# EAGLE design ADAC-Shield (EAGLE 6.5.0)
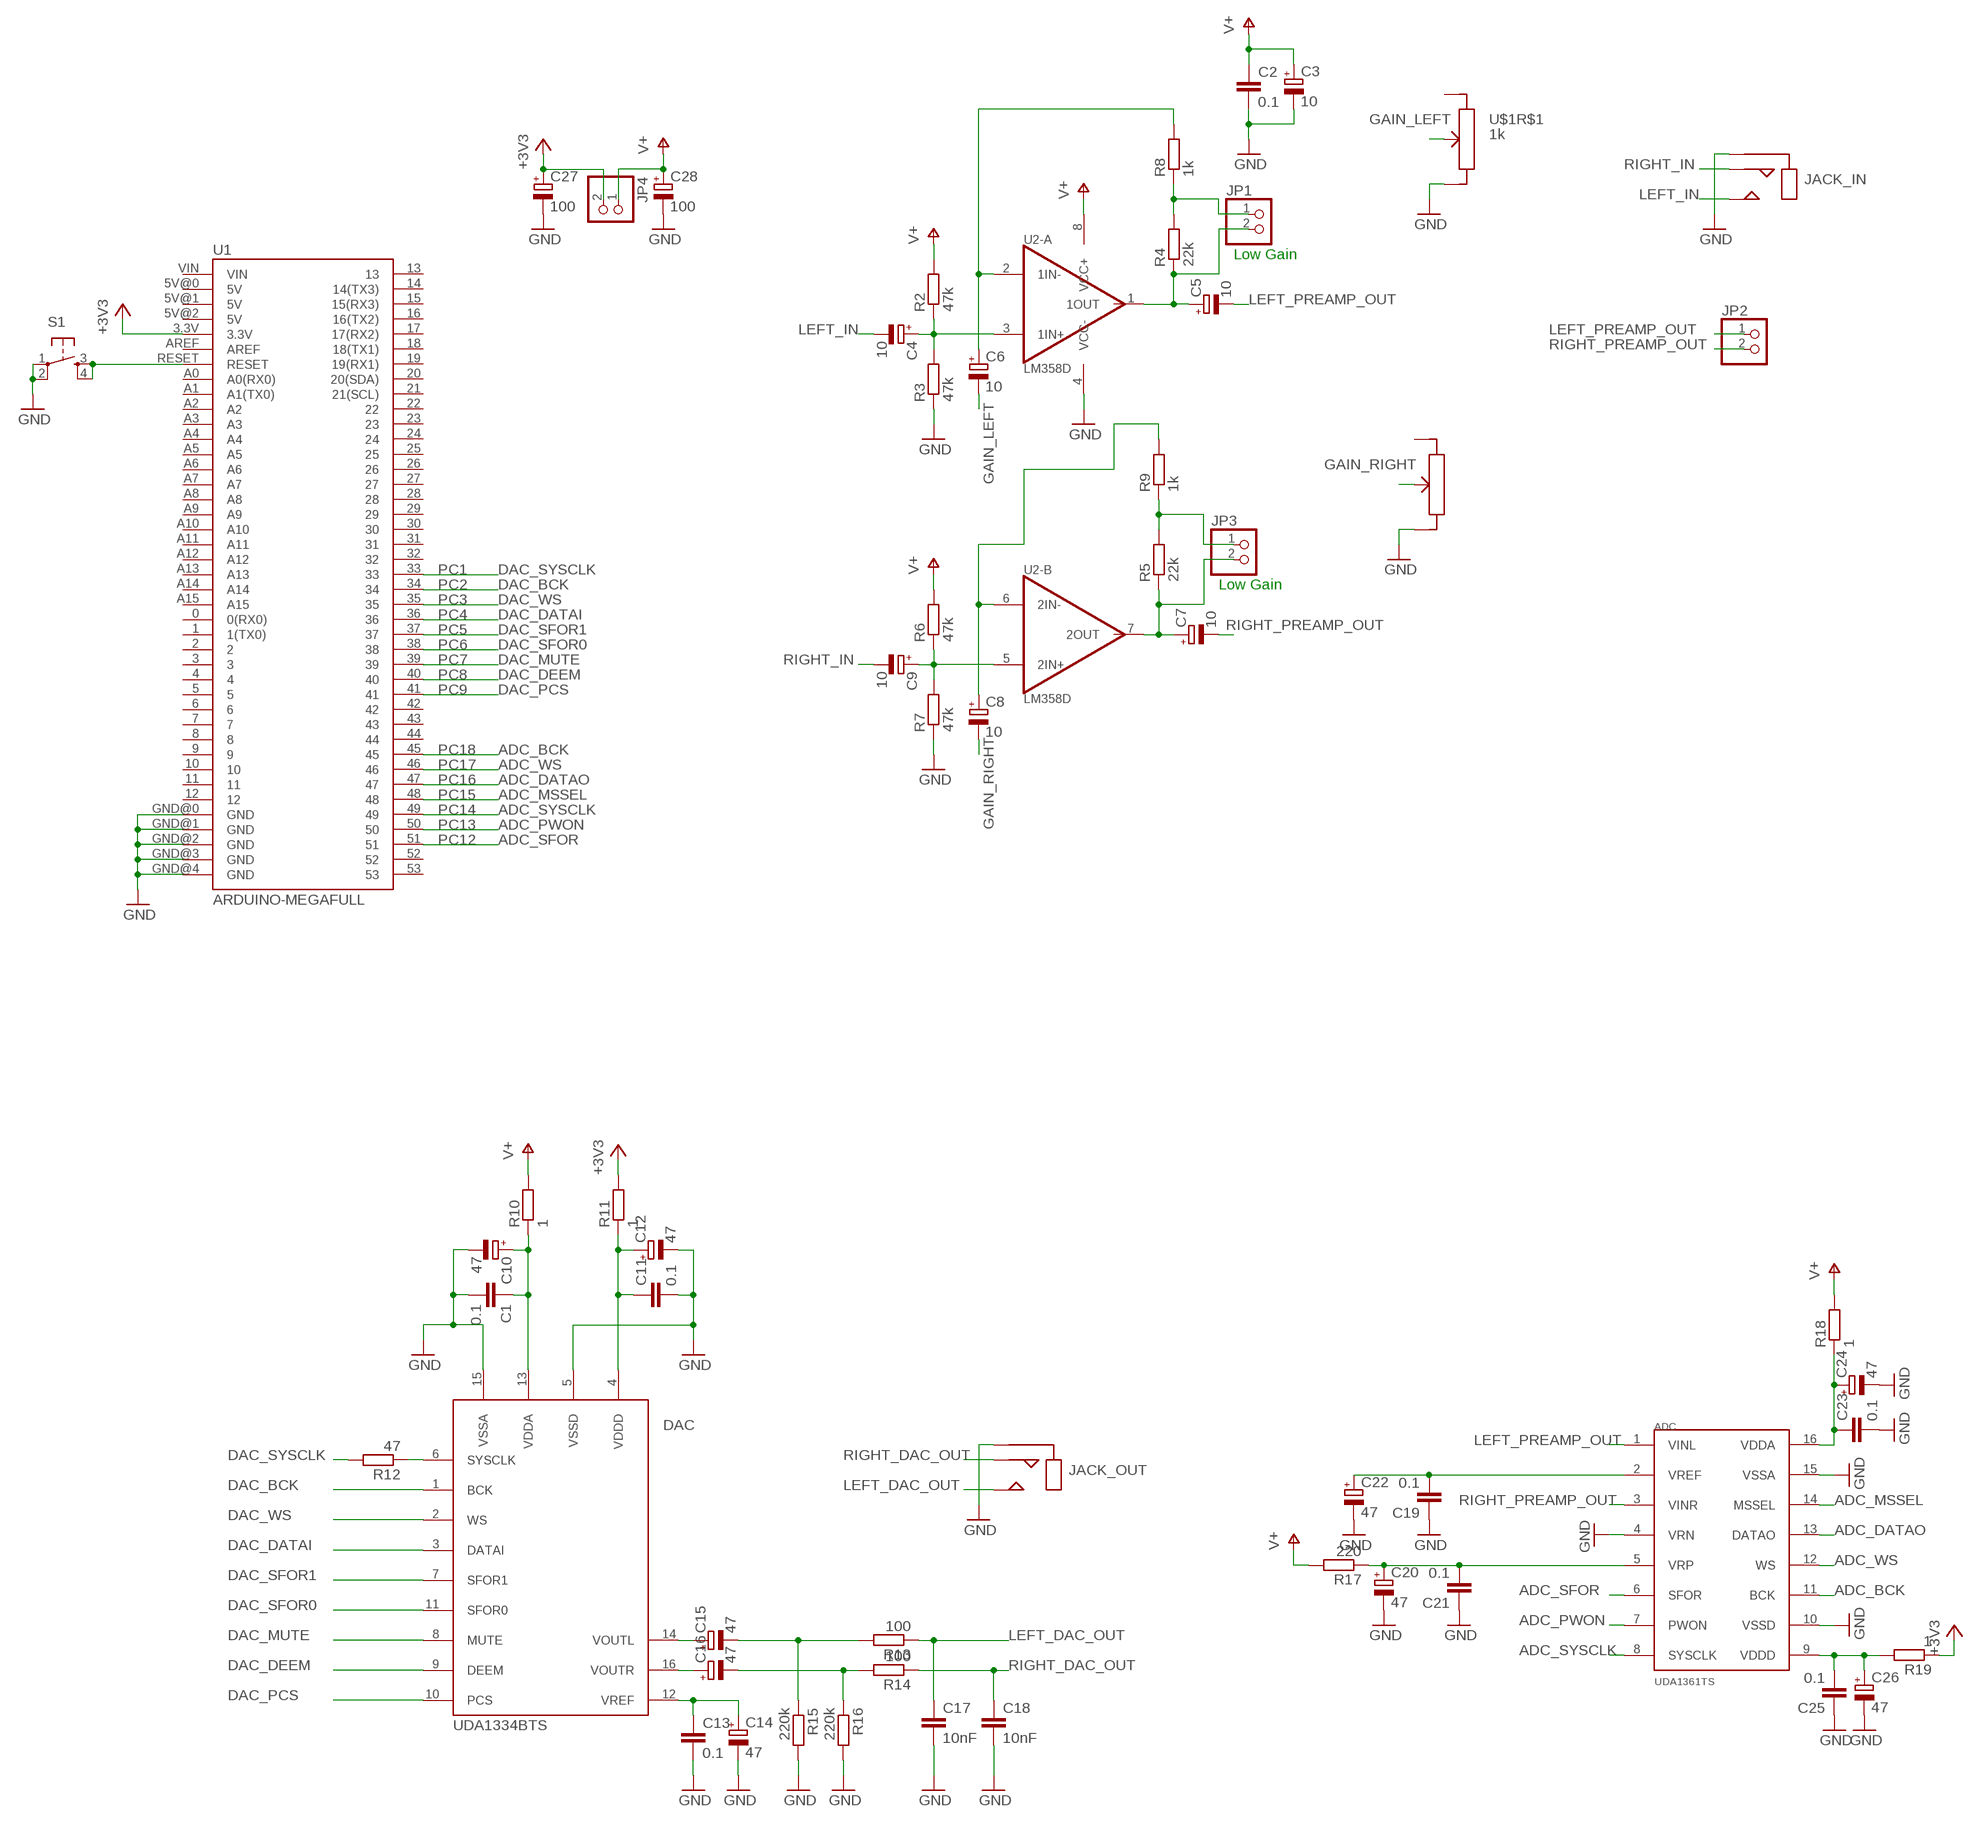
[diagram p0: schematic, sheet 1]

## Parts
ADC  UDA1361TS  [SSOP16]
C1  0.1  C-EUC0805  [C0805]
C2  0.1  C-EUC0805  [C0805]
C3  10  CPOL-EUA  [PANASONIC_A]
C4  10  CPOL-EUA  [PANASONIC_A]
C5  10  CPOL-EUA  [PANASONIC_A]
C6  10  CPOL-EUA  [PANASONIC_A]
C7  10  CPOL-EUA  [PANASONIC_A]
C8  10  CPOL-EUA  [PANASONIC_A]
C9  10  CPOL-EUA  [PANASONIC_A]
C10  47  CPOL-EUA  [PANASONIC_A]
C11  0.1  C-EUC0805  [C0805]
C12  47  CPOL-EUA  [PANASONIC_A]
C13  0.1  C-EUC0805  [C0805]
C14  47  CPOL-EUA  [PANASONIC_A]
C15  47  CPOL-EUA  [PANASONIC_A]
C16  47  CPOL-EUA  [PANASONIC_A]
C17  10nF  C-EUC0805  [C0805]
C18  10nF  C-EUC0805  [C0805]
C19  0.1  C-EUC0805  [C0805]
C20  47  CPOL-EUA  [PANASONIC_A]
C21  0.1  C-EUC0805  [C0805]
C22  47  CPOL-EUA  [PANASONIC_A]
C23  0.1  C-EUC0805  [C0805]
C24  47  CPOL-EUA  [PANASONIC_A]
C25  0.1  C-EUC0805  [C0805]
C26  47  CPOL-EUA  [PANASONIC_A]
C27  100  CPOL-EUB  [PANASONIC_B]
C28  100  CPOL-EUB  [PANASONIC_B]
DAC  UDA1334BTS  [SSOP16]
JACK_IN  ST-11M-0  [ST-11M-0]
JACK_OUT  ST-11M-0  [ST-11M-0]
JP1  PINHD-1X2  [1X02]
JP2  PINHD-1X2  [1X02]
JP3  PINHD-1X2  [1X02]
JP4  PINHD-1X2  [1X02]
R2  47k  R-EU_R0805  [R0805]
R3  47k  R-EU_R0805  [R0805]
R4  22k  R-EU_R0805  [R0805]
R5  22k  R-EU_R0805  [R0805]
R6  47k  R-EU_R0805  [R0805]
R7  47k  R-EU_R0805  [R0805]
R8  1k  R-EU_R0805  [R0805]
R9  1k  R-EU_R0805  [R0805]
R10  1  R-EU_R0805  [R0805]
R11  1  R-EU_R0805  [R0805]
R12  47  R-EU_R0805  [R0805]
R13  100  R-EU_R0805  [R0805]
R14  100  R-EU_R0805  [R0805]
R15  220k  R-EU_R0805  [R0805]
R16  220k  R-EU_R0805  [R0805]
R17  220  R-EU_R0805  [R0805]
R18  1  R-EU_R0805  [R0805]
R19  1  R-EU_R0805  [R0805]
S1  TAC_SWITCHSMD  [TACTILE_SWITCH_SMD]
U1  ARDUINO-MEGAFULL  [ARDUINO_MEGA]
U2  LM358D  1680-LM358DT  [ANDREW/B37Z6]
U$1  1k  POT_DUAL_R16  [POT_DUAL_R16]

## Nets
+3V3: C27.+ JP4.2 R11.2 R19.1 U1.3.3V
ADC_BCK: ADC.11(BCK) U1.45
ADC_DATAO: ADC.13(DATAO) U1.47
ADC_MSSEL: ADC.14(MSSEL) U1.48
ADC_PWON: ADC.7(PWON) U1.50
ADC_SFOR: ADC.6(SFOR) U1.51
ADC_SYSCLK: ADC.8(SYSCLK) U1.49
ADC_WS: ADC.12(WS) U1.46
DAC_BCK: DAC.1(BCK) U1.34
DAC_DATAI: DAC.3(DATAI) U1.36
DAC_DEEM: DAC.9(DEEM) U1.40
DAC_MUTE: DAC.8(MUTE) U1.39
DAC_PCS: DAC.10(PCS) U1.41
DAC_SFOR0: DAC.11(SFOR0) U1.38
DAC_SFOR1: DAC.7(SFOR1) U1.37
DAC_SYSCLK: R12.2 U1.33
DAC_WS: DAC.2(WS) U1.35
GAIN_LEFT: C6.- U$1.TRIMMER(R$1:TRIMMER)
GAIN_RIGHT: C8.- U$1.TRIMMER2
GND: ADC.4(VRN) ADC.10(VSSD) ADC.15(VSSA) C1.2 C2.2 C3.- C10.- C11.2 C12.- C13.2 C14.- C17.2 C18.2 C19.1 C20.- C21.1 C22.- C23.2 C24.- C25.1 C26.- C27.- C28.- DAC.5(VSSD) DAC.15(VSSA) JACK_IN.SLEEVE JACK_OUT.SLEEVE R3.1 R7.1 R15.2 R16.2 S1.1 S1.2 U1.GND@0(GND) U1.GND@1(GND) U1.GND@2(GND) U1.GND@3(GND) U1.GND@4(GND) U2.4(-A:VCC-) U$1.BOTTOM2 U$1.BOTTOM(R$1:BOTTOM)
LEFT_DAC_OUT: C17.1 JACK_OUT.TIP R13.1
LEFT_IN: C4.- JACK_IN.TIP
LEFT_PREAMP_OUT: ADC.1(VINL) C5.- JP2.1
N$1: C4.+ R2.1 R3.2 U2.3(-A:1IN+)
N$2: C5.+ JP1.2 R4.1 U2.1(-A:1OUT)
N$3: S1.3 S1.4 U1.RESET
N$4: C6.+ R8.2 U2.2(-A:1IN-)
N$5: C7.+ JP3.2 R5.1 U2.7(-B:2OUT)
N$6: C11.1 C12.+ DAC.4(VDDD) R11.1
N$7: C8.+ R9.2 U2.6(-B:2IN-)
N$8: C9.+ R6.1 R7.2 U2.5(-B:2IN+)
N$9: JP1.1 R4.2 R8.1
N$10: C1.1 C10.+ DAC.13(VDDA) R10.1
N$11: JP3.1 R5.2 R9.1
N$12: DAC.6(SYSCLK) R12.1
N$13: C13.1 C14.+ DAC.12(VREF)
N$14: C15.+ DAC.14(VOUTL)
N$15: C16.+ DAC.16(VOUTR)
N$16: C15.- R13.2 R15.1
N$17: C16.- R14.2 R16.1
N$18: ADC.2(VREF) C19.2 C22.+
N$19: ADC.5(VRP) C20.+ C21.2 R17.1
N$20: ADC.16(VDDA) C23.1 C24.+ R18.1
N$25: ADC.9(VDDD) C25.2 C26.+ R19.2
RIGHT_DAC_OUT: C18.1 JACK_OUT.RING R14.1
RIGHT_IN: C9.- JACK_IN.RING
RIGHT_PREAMP_OUT: ADC.3(VINR) C7.- JP2.2
V+: C2.1 C3.+ C28.+ JP4.1 R2.2 R6.2 R10.2 R17.2 R18.2 U2.8(-A:VCC+)
Unconnected: U1.0(0(RX0)) U1.1(1(TX0)) U1.2 U1.3 U1.4 U1.5 U1.5V@0(5V) U1.5V@1(5V) U1.5V@2(5V) U1.6 U1.7 U1.8 U1.9 U1.10 U1.11 U1.12 U1.13 U1.14(14(TX3)) U1.15(15(RX3)) U1.16(16(TX2)) U1.17(17(RX2)) U1.18(18(TX1)) U1.19(19(RX1)) U1.20(20(SDA)) U1.21(21(SCL)) U1.22 U1.23 U1.24 U1.25 U1.26 U1.27 U1.28 U1.29 U1.30 U1.31 U1.32 U1.42 U1.43 U1.44 U1.52 U1.53 U1.A0(A0(RX0)) U1.A1(A1(TX0)) U1.A2 U1.A3 U1.A4 U1.A5 U1.A6 U1.A7 U1.A8 U1.A9 U1.A10 U1.A11 U1.A12 U1.A13 U1.A14 U1.A15 U1.AREF U1.VIN U$1.UPPER2 U$1.UPPER(R$1:UPPER)

## Notes on the sheet
- Low Gain
- PC1
- PC2 | Low Gain
- PC3
- PC4
- PC5
- PC6
- PC7
- PC8
- PC9
- PC18
- PC17
- PC16
- PC15
- PC14
- PC13
- PC12

## Library data of the parts
ADC = smok:UDA1361TS: 96 kHz sampling 24-bit stereo audio ADC by Philips, http://www.rcscomponents.kiev.ua/modules/Asers_Shop/images/datasheets/UDA1361TS-N1%2C112.pdf
C1 C2 C11 C13 C17-C19 C21 C23 C25 = rcl:C-EU: CAPACITOR, European symbol
C3-C10 C12 C14-C16 C20 C22 C24 C26-C28 = rcl:CPOL-EU: POLARIZED CAPACITOR, European symbol
DAC = smok:UDA1334BTS: Low-power audio DAC by Philips, http://www.rcscomponents.kiev.ua/modules/Asers_Shop/images/datasheets/UDA1334BTS.pdf
JACK_IN JACK_OUT = smok:ST-11M-0: Audio jack narrow, http://www.rcscomponents.kiev.ua/modules/Asers_Shop/images/datasheets/ST-11M-0.pdf
JP1-JP4 = pinhead:PINHD-1X2: PIN HEADER
R2-R19 = rcl:R-EU_: RESISTOR, European symbol
S1 = SparkFun-Electromechanical:TAC_SWITCH: Momentary Switch Button commonly used for reset or general input. Spark Fun Electronics SKU : COM-00097 SMT- SWCH-08247; PROD_ID: SWCH-08247
U1 = SparkFun-Boards_modified:ARDUINO-MEGA: Arduino Mega board footprint
U2 = CircuitHub:1680-LM358DT; CIRCUITHUBID: 1680; FOOTPRINTREVISION: 2b0cb5c555c6535bfd0703ddb6519a7d2d03b0a4; FOOTPRINTURN: andrew/b37z6; SYMBOLREVISION: bf7dcb01558d8fc67fecfd6692ad2b1a99a1aebf; SYMBOLURN: wsender/dinu3; URL: https://circuithub.com/parts/STMICRO/LM358DT
U$1 = smok:POT_DUAL_R16: dual potentiometer, uknown brand, sold as R16. http://www.rcscomponents.kiev.ua/modules/Asers_Shop/images/datasheets/di2yt3i7tr8eggy82teufg562w3r.jpg

## Board
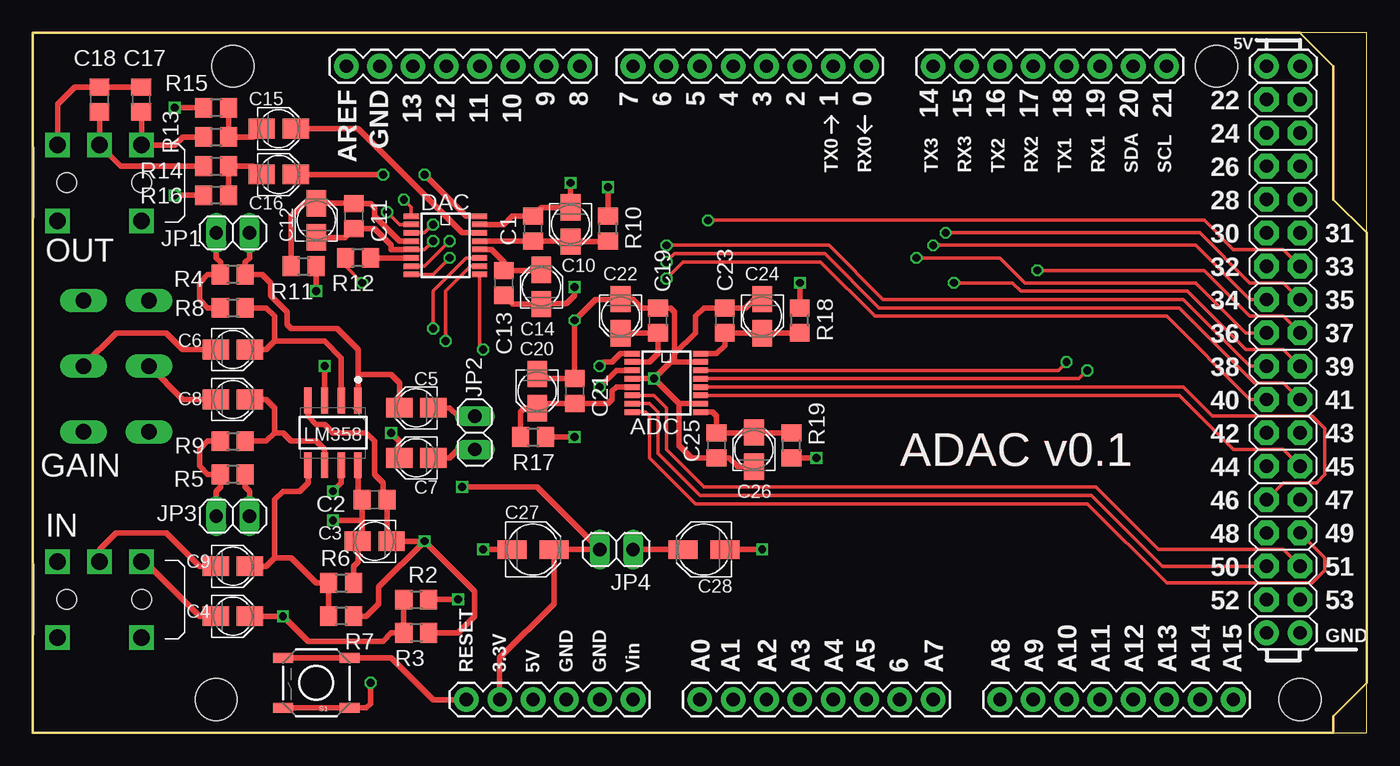
[diagram p1: board, top side]
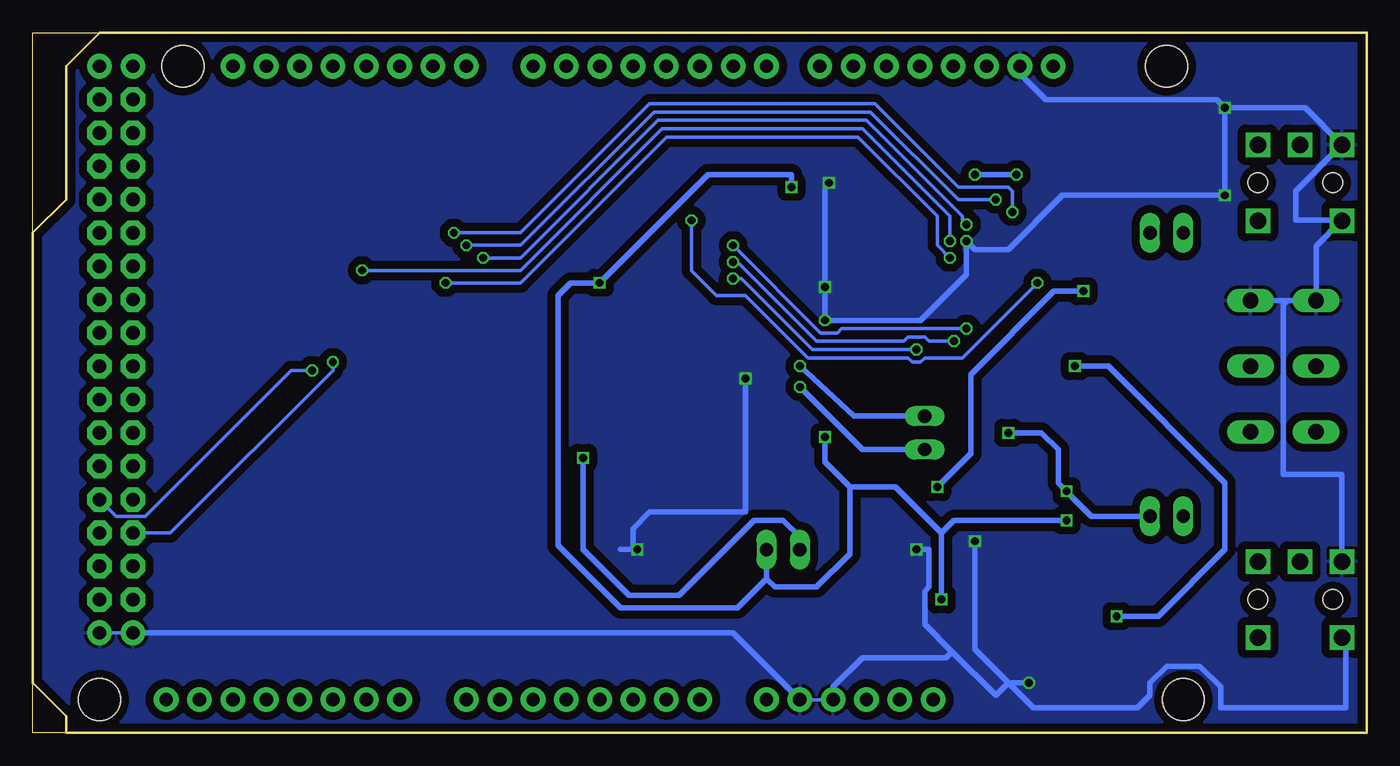
[diagram p2: board, bottom side, seen from below]

Size 101.6 x 53.34 mm. Coordinates in mm from the lower left corner, seen from the top.
Outline: 0,0 101.59,0 101.59,53.33 0,53.33 0,0
Copper layers (1*16): Top 0.035mm / dielectric 1.5mm / Bottom 0.035mm
Design rules "ITEADstudio_DRC": minimum track width 6mil, minimum drill 12mil, track to track 6mil, track to pad 6mil, pad to pad 6mil, via to via 6mil, smd to smd 0mil, copper to edge 10mil, drill to drill 10mil, minimum pad ring 10mil, minimum via ring 6mil, stop-mask expansion 2mil, vias tented up to drill 100mil, thermal gap 10mil

### Footprints (pad centres in the part's own frame; a part is rotated, then mirrored left to right if it is on the bottom)
SSOP16 = smd 0.419 x 1.143: 1 -2.223,-2.6; 2 -1.587,-2.6; 3 -0.953,-2.6; 4 -0.318,-2.6; 5 0.318,-2.6; 6 0.953,-2.6; 7 1.587,-2.6; 8 2.223,-2.6; 9 2.223,2.6; 10 1.587,2.6; 11 0.953,2.6; 12 0.318,2.6; 13 -0.318,2.6; 14 -0.953,2.6; 15 -1.587,2.6; 16 -2.223,2.6
C0805 = smd 1.3 x 1.5: 1 -0.95,0; 2 0.95,0
PANASONIC_A = smd 2 x 1.5: + 1.3,0; - -1.3,0
PANASONIC_B = smd 2.2 x 1.4: + 1.6,0; - -1.6,0
ST-11M-0 = drill 1.25 square: RING 0,2.9; SLEEVE -3.2,2.9; SLEEVE2 -3.2,-2.9; TIP 3.2,2.9; TIP2 3.2,-2.9 | hole 1.5: -2.5,0; 3.2,0
1X02 = drill 1.016 long: 1 -1.27,0; 2 1.27,0
R0805 = smd 1.3 x 1.5: 1 -0.95,0; 2 0.95,0
TACTILE_SWITCH_SMD = smd 1.524 x 0.762: 1 -2.54,1.905; 2 2.54,1.905; 3 -2.54,-1.905; 4 2.54,-1.905
ARDUINO_MEGA = drill 1.016 pad 1.88: 0 63.5,50.8; 1 60.96,50.8; 2 58.42,50.8; 3 55.88,50.8; 3.3V 35.56,2.54; 4 53.34,50.8; 5 50.8,50.8; 5V@0 38.1,2.54; 5V@1 93.98,50.8; 5V@2 96.52,50.8; 6 48.26,50.8; 7 45.72,50.8; 8 41.656,50.8; 9 39.116,50.8; 10 36.576,50.8; 11 34.036,50.8; 12 31.496,50.8; 13 28.956,50.8; 14 68.58,50.8; 15 71.12,50.8; 16 73.66,50.8; 17 76.2,50.8; 18 78.74,50.8; 19 81.28,50.8; 20 83.82,50.8; 21 86.36,50.8; A0 50.8,2.54; A1 53.34,2.54; A2 55.88,2.54; A3 58.42,2.54; A4 60.96,2.54; A5 63.5,2.54; A6 66.04,2.54; A7 68.58,2.54; A8 73.66,2.54; A9 76.2,2.54; A10 78.74,2.54; A11 81.28,2.54; A12 83.82,2.54; A13 86.36,2.54; A14 88.9,2.54; A15 91.44,2.54; AREF 23.876,50.8; GND@0 40.64,2.54; GND@1 43.18,2.54; GND@2 93.98,7.62; GND@3 96.52,7.62; GND@4 26.416,50.8; RESET 33.02,2.54; VIN 45.72,2.54 | drill 1.016 pad 1.88 octagon: 22 93.98,48.26; 23 96.52,48.26; 24 93.98,45.72; 25 96.52,45.72; 26 93.98,43.18; 27 96.52,43.18; 28 93.98,40.64; 29 96.52,40.64; 30 93.98,38.1; 31 96.52,38.1; 32 93.98,35.56; 33 96.52,35.56; 34 93.98,33.02; 35 96.52,33.02; 36 93.98,30.48; 37 96.52,30.48; 38 93.98,27.94; 39 96.52,27.94; 40 93.98,25.4; 41 96.52,25.4; 42 93.98,22.86; 43 96.52,22.86; 44 93.98,20.32; 45 96.52,20.32; 46 93.98,17.78; 47 96.52,17.78; 48 93.98,15.24; 49 96.52,15.24; 50 93.98,12.7; 51 96.52,12.7; 52 93.98,10.16; 53 96.52,10.16 | hole 3.2: 15.24,50.8; 13.97,2.54; 90.17,50.8; 96.52,2.54
ANDREW/B37Z6 = smd 0.55 x 1.958: 1 -1.905,-2.471; 2 -0.635,-2.471; 3 0.635,-2.471; 4 1.905,-2.471; 5 1.905,2.471; 6 0.635,2.471; 7 -0.635,2.471; 8 -1.905,2.471
POT_DUAL_R16 = drill 1.2 long: BOTTOM 2.5,-5; BOTTOM2 -2.5,-5; TRIMMER 2.5,0; TRIMMER2 -2.5,0; UPPER 2.5,5; UPPER2 -2.5,5

### Placement (x,y rotation side)
ADC  48.26,26.67 270 top
C1  38.1,38.42 90 top
C2  26.04,17.78 0 top
C3  26.04,14.61 180 top
C4  15.24,8.89 0 top
C5  29.21,24.77 180 top
C6  15.24,29.21 0 top
C7  29.21,20.95 180 top
C8  15.24,25.4 0 top
C9  15.24,12.7 0 top
C10  40.96,38.73 270 top
C11  24.45,39.37 270 top
C12  21.59,39.05 90 top
C13  35.88,34.29 270 top
C14  38.73,33.97 90 top
C15  18.73,46.04 0 top
C16  18.73,42.55 0 top
C17  8.26,48.26 90 top
C18  5.08,48.26 90 top
C19  47.62,31.43 270 top
C20  38.42,26.04 270 top
C21  41.27,26.04 270 top
C22  44.77,31.75 270 top
C23  52.7,31.43 90 top
C24  55.56,31.75 270 top
C25  52.07,21.91 90 top
C26  54.93,21.59 90 top
C27  38.1,13.97 0 top
C28  51.12,13.97 180 top
DAC  31.43,37.15 270 top
JACK_IN  5.08,10.16 0 top
JACK_OUT  5.08,41.91 0 top
JP1  15.24,38.1 0 top
JP2  33.66,22.86 270 top
JP3  15.24,16.51 0 top
JP4  44.45,13.97 180 top
R2  29.21,10.16 0 top
R3  29.21,7.62 180 top
R4  15.24,34.92 180 top
R5  15.24,19.68 180 top
R6  23.5,11.43 0 top
R7  23.5,8.89 180 top
R8  15.24,32.38 0 top
R9  15.24,22.23 0 top
R10  43.81,38.42 90 top
R11  20.64,35.56 0 top
R12  24.77,36.2 180 top
R13  13.97,45.4 0 top
R14  13.97,43.18 0 top
R15  13.97,47.62 180 top
R16  13.97,40.96 180 top
R17  38.1,22.54 0 top
R18  58.42,31.43 90 top
R19  57.78,21.91 90 top
S1  21.59,3.81 180 top
U1  0,0 0 top
U2  22.86,22.86 180 top
U$1  6.35,27.94 180 top

### Tracks (layer width: path | path; a pad name or v marks a point on that pad's centre or on a via)
+3V3  (via drill 0.6)
  Top 0.406: R19.1 v59.69,20.96 v59.69,20.95 | R11.2 v21.59,33.66 | v32.7,18.73 38.42,18.73 JP4.2 C27.+ 39.69,13.96 39.69,9.84 35.56,5.71 U1.3.3V
  Bottom 0.406: JP4.2 43.18,14.92 44.45,16.19 46.67,16.19 52.39,10.48 56.2,10.48 59.69,13.97 v59.69,20.95 | v21.59,33.66 23.81,33.66 30.16,27.3 30.16,21.27 v32.7,18.73
ADC_BCK
  Top 0.254: ADC.11 87.31,25.72 91.44,21.59 95.25,21.59 U1.45
ADC_DATAO  (via drill 0.6)
  Top 0.254: ADC.13 79.69,26.99 v80.33,27.62
  Bottom 0.254: v80.33,27.62 81.92,27.62 93.03,16.51 95.25,16.51 U1.47
ADC_MSSEL  (via drill 0.6)
  Top 0.254: ADC.14 78.11,27.62 v78.74,28.26
  Bottom 0.254: v78.74,28.26 78.74,27.62 91.12,15.24 U1.48
ADC_PWON
  Top 0.254: ADC.7 46.99,25.08 47.62,24.45 47.62,21.27 50.8,18.1 80.64,18.1 86.04,12.7 U1.50
ADC_SFOR
  Top 0.254: ADC.6 47.31,25.72 48.26,24.77 48.26,21.59 51.12,18.73 80.96,18.73 85.72,13.97 95.25,13.97 U1.51
ADC_SYSCLK
  Top 0.254: ADC.8 46.67,24.45 46.99,24.13 46.99,20.95 50.48,17.46 80.33,17.46 86.36,11.43 97.47,11.43 98.42,12.38 98.42,13.34 U1.49
ADC_WS
  Top 0.254: ADC.12 87.63,26.35 89.85,24.13 97.47,24.13 98.42,23.18 98.42,19.68 97.79,19.05 95.25,19.05 U1.46
DAC_BCK  (via drill 0.6)
  Top 0.254: DAC.1 28.83,40.06 v28.26,40.64 | v68.58,37.15 88.58,37.15 92.71,33.02 U1.34
  Bottom 0.254: v28.26,40.64 31.11,40.64 37.78,47.31 54.29,47.31 64.45,37.15 v68.58,37.15
DAC_DATAI  (via drill 0.6)
  Top 0.254: v67.31,36.2 73.66,36.2 75.56,34.29 88.58,34.29 92.39,30.48 U1.36 | DAC.3 29.84,38.1 v30.48,38.73
  Bottom 0.254: v67.31,36.2 64.45,36.2 53.98,46.67 38.1,46.67 30.8,39.37 30.8,39.05 v30.48,38.73
DAC_DEEM  (via drill 0.6)
  Top 0.254: DAC.9 34.03,29.47 v34.29,29.21 | v48.26,34.61 49.53,35.88 60.01,35.88 64.14,31.75 86.36,31.75 92.71,25.4 U1.40
  Bottom 0.254: v34.29,29.21 42.23,29.21 47.62,34.61 v48.26,34.61
DAC_MUTE  (via drill 0.6)
  Top 0.254: v70.17,34.29 74.61,34.29 75.25,33.66 87.95,33.66 92.39,29.21 95.25,29.21 U1.39 | DAC.8 30.48,34.92 v31.75,36.2
  Bottom 0.254: v70.17,34.29 64.45,34.29 53.34,45.4 38.73,45.4 32.7,39.37 32.7,37.15 v31.75,36.2
DAC_PCS  (via drill 0.6)
  Top 0.254: DAC.10 33.34,35.56 31.43,33.66 v31.43,29.84 | v48.26,35.88 48.9,36.51 60.33,36.51 64.45,32.38 87.31,32.38 93.03,26.67 95.25,26.67 U1.41
  Bottom 0.254: v48.26,35.88 47.94,35.88 41.91,29.84 35.24,29.84 34.92,30.16 33.66,30.16 33.34,29.84 v31.43,29.84
DAC_SFOR0  (via drill 0.6)
  Top 0.254: DAC.11 33.02,36.2 30.48,33.66 v30.48,30.8 | v48.26,37.15 60.64,37.15 64.77,33.02 87.63,33.02 92.71,27.94 U1.38
  Bottom 0.254: v30.48,30.8 40.01,30.8 40.32,30.48 41.59,30.48 v48.26,37.15
DAC_SFOR1  (via drill 0.6)
  Top 0.254: v76.52,35.24 89.22,35.24 92.71,31.75 95.25,31.75 U1.37 | DAC.7 29.84,35.56 v31.75,37.47
  Bottom 0.254: v31.75,37.47 31.75,39.37 38.42,46.04 53.66,46.04 64.45,35.24 v76.52,35.24
DAC_SYSCLK  (via drill 0.6)
  Top 0.254: R12.2 23.82,35.56 v25.08,34.29 | v51.44,39.05 89.22,39.05 91.44,36.83 95.25,36.83 U1.33
  Bottom 0.254: v25.08,34.29 30.8,28.57 33.66,28.57 33.97,28.26 34.61,28.26 34.92,28.57 42.55,28.57 47.31,33.34 49.53,33.34 51.44,35.24 v51.44,39.05
DAC_WS  (via drill 0.6)
  Top 0.254: DAC.2 27.94,38.73 v26.99,39.69 | v69.53,38.1 88.9,38.1 92.71,34.29 95.25,34.29 U1.35
  Bottom 0.254: v26.99,39.69 26.99,41.27 27.3,41.59 31.11,41.59 37.47,47.94 54.61,47.94 64.45,38.1 v69.53,38.1
GAIN_LEFT
  Top 0.406: U$1.TRIMMER 3.85,27.98 6.35,30.48 10.16,30.48 11.43,29.21 C6.-
GAIN_RIGHT
  Top 0.406: U$1.TRIMMER2 8.89,27.94 11.43,25.4 C8.-
GND  (via drill 0.6)
  Top 0.254: DAC.5 29.84,36.83 v30.48,37.47
  Top 0.406: U2.4 20.95,24.13 21.59,23.5 22.23,23.5 22.86,22.86 25.4,22.86 26.04,22.23 26.04,19.68 26.67,19.05 26.67,18.09 C2.2 26.98,14.96 C3.- v29.84,14.61 | ADC.4 v47.31,26.99 | ADC.10 49.21,25.08 | 49.21,25.08 v47.31,26.99 | ADC.15 48.58,28.26 | 48.58,28.26 v47.31,26.99 | C19.1 46.35,32.38 45.69,33.05 C22.- 44.74,33.02 42.86,33.02 v41.27,31.43 C21.1 38.77,26.98 C20.- | C19.1 | C19.1 48.58,32.38 48.9,32.07 48.9,28.89 | 48.9,28.89 48.9,28.57 48.58,28.26 | R7.1 25.4,8.89 26.35,9.84 26.35,11.11 v29.84,14.61 | R3.1 32.38,7.62 33.66,8.89 33.66,10.79 v29.84,14.61 | C24.- 54.96,33.05 54.29,32.38 C23.2 51.12,32.38 50.48,31.75 50.48,30.48 48.9,28.89 | C25.1 53.02,20.96 53.02,20.95 | 53.66,20.32 54.9,20.32 C26.- 53.69,20.29 53.66,20.32 | 53.66,20.32 53.02,20.95 | 53.02,20.95 50.16,20.95 49.21,21.91 49.21,25.08 | C17.2 C18.2 3.17,49.21 1.88,47.92 JACK_OUT.SLEEVE | R15.2 v10.79,47.62 | DAC.15 35.88,38.73 36.51,39.37 36.52,39.37 C1.2 38.77,40.03 C10.- v40.96,41.91 | DAC.5 27.3,36.83 27.3,37.15 26.03,38.42 C11.2 23.78,37.75 C12.- | C13.2 36.55,32.67 C14.- 38.77,32.7 40.64,32.7 41.27,33.34 v41.27,33.97 | C27.- v34.29,13.97 | C28.- v55.56,13.97 | R16.2 v10.79,40.96 | S1.2 S1.1 25.4,1.91 25.72,2.22 v25.72,3.81
  Bottom 0.254: U1.GND@3 U1.GND@2 | U1.GND@1 U1.GND@0
  Bottom 0.406: U$1.BOTTOM2 6.03,32.94 | 6.03,32.94 U$1.BOTTOM 3.85,37.11 1.91,39.05 5.4,39.05 5.4,41.29 JACK_OUT.SLEEVE | 1.91,44.78 JACK_OUT.SLEEVE | v47.31,26.99 47.31,16.83 54.61,16.83 55.88,15.56 55.88,14.29 v55.56,13.97 56.83,13.97 | v29.84,14.61 29.84,6.35 27.3,3.81 | 27.3,3.81 27.15,3.65 | 27.15,3.65 25.4,1.91 17.46,1.91 16.51,2.86 16.51,3.81 15.24,5.08 12.7,5.08 11.11,3.49 11.11,1.91 1.59,1.91 1.59,6.99 1.91,7.3 | 1.91,13.04 JACK_IN.SLEEVE 1.88,19.71 6.33,19.71 6.35,19.68 6.35,32.62 6.03,32.94 | v10.79,47.62 v10.79,40.96 23.18,40.96 27.3,36.83 29.84,36.83 v30.48,37.47 30.48,34.92 33.97,31.43 v41.27,31.43 v41.27,33.97 41.27,41.59 v40.96,41.91 | v34.29,13.97 33.34,13.97 33.34,11.11 33.66,10.79 33.66,8.26 31.59,6.19 | 27.3,3.81 28.26,2.86 31.59,6.19 | v10.79,47.62 4.7,47.62 JACK_OUT.SLEEVE | U1.GND@4 26.42,50.23 24.45,48.26 11.43,48.26 v10.79,47.62 | U1.GND@2 48.26,7.62 U1.GND@1 | U1.GND@0 40.64,3.49 38.42,5.71 32.07,5.71 31.59,6.19 | v25.72,3.81 26.99,3.81 27.15,3.65
  pour Bottom (isolate 0.61): 0.64,53.02 96.52,53.02 98.74,50.8 98.74,40.64 101.28,38.1 101.28,3.81 98.74,1.27 98.74,0.32 0.32,0.32 0.32,53.02
LEFT_DAC_OUT
  Top 0.406: C17.1 8.28,47.28 JACK_OUT.TIP 8.32,44.77 10.79,44.77 11.43,45.4 R13.1
LEFT_IN
  Top 0.406: JACK_IN.TIP 8.53,13.06 12.7,8.89 C4.-
LEFT_PREAMP_OUT  (via drill 0.6)
  Top 0.406: C5.- 31.75,24.77 32.38,24.13 JP2.1 | ADC.1 44.77,28.89 44.13,28.26 43.5,28.26 v43.18,27.94
  Bottom 0.406: v43.18,27.94 39.05,24.13 JP2.1
N$1  (via drill 0.6)
  Top 0.406: C4.+ v19.05,8.89 20.95,6.99 26.67,6.99 27.3,7.62 R3.2 R2.1 | v22.23,27.94 U2.3
  Bottom 0.406: v19.05,8.89 15.88,8.89 10.79,13.97 10.79,19.05 19.68,27.94 v22.23,27.94
N$2
  Top 0.406: JP1.2 16.51,36.2 16.19,35.88 R4.1 17.46,34.92 18.1,34.29 18.1,33.34 19.37,32.07 19.37,31.11 19.68,30.8 23.18,30.8 24.77,29.21 24.77,27.3 | 24.77,27.3 27.3,27.3 27.94,26.67 27.94,24.8 C5.+ | U2.1 24.77,27.3
N$3
  Top 0.406: S1.3 S1.4 27.3,5.71 30.48,2.54 U1.RESET
N$4
  Top 0.406: 16.51,29.24 C6.+ 17.78,29.21 18.41,29.84 | R8.2 17.78,32.38 18.41,31.75 18.41,29.84 | U2.2 23.5,28.57 22.23,29.84 18.41,29.84
N$5  (via drill 0.6)
  Top 0.406: C7.+ 27.91,22.25 v27.3,22.86 | v22.86,18.41 23.5,19.05 U2.7 | R5.1 16.19,18.73 16.51,18.41 JP3.2
  Bottom 0.406: v27.3,22.86 24.77,22.86 23.5,21.59 23.5,19.05 v22.86,18.41 20.95,16.51 JP3.2
N$6
  Top 0.406: DAC.4 27.94,37.47 26.04,39.37 26.04,40.01 25.72,40.32 25.71,40.32 C11.1 24.41,40.35 C12.+ 20.67,40.35 19.68,39.37 R11.1
N$7
  Top 0.406: R9.2 17.78,22.23 18.41,22.86 | 18.41,22.86 18.41,24.77 17.78,25.4 C8.+ | U2.6 22.23,21.59 21.59,22.23 19.68,22.23 19.05,22.86 18.41,22.86
N$8
  Top 0.406: C9.+ 17.78,12.7 18.41,13.34 | 18.41,13.34 18.41,17.78 19.05,18.41 20.32,18.41 20.95,19.05 U2.5 | R7.2 R6.1 21.59,11.43 19.68,13.34 18.41,13.34
N$9
  Top 0.406: R8.1 13.34,32.38 12.7,33.02 12.7,34.29 13.34,34.92 R4.2 14.29,35.88 13.97,36.2 JP1.1
N$10
  Top 0.406: R10.1 43.78,37.44 C10.+ 40.92,37.47 C1.1 DAC.13
N$11
  Top 0.406: R9.1 13.34,22.23 12.7,21.59 12.7,20.32 13.34,19.68 R5.2 14.29,18.73 13.97,18.41 JP3.1
N$12
  Top 0.406: DAC.6 R12.1
N$13
  Top 0.406: C14.+ 38.7,35.24 C13.1 35.88,35.88 34.92,36.83 DAC.12
N$14
  Top 0.406: DAC.14 32.7,38.1 24.77,46.04 C15.+
N$15  (via drill 0.6)
  Top 0.406: DAC.16 33.02,39.37 v29.84,42.55 | v26.67,42.55 C16.+
  Bottom 0.406: v29.84,42.55 v26.67,42.55
N$16
  Top 0.406: R15.1 R13.2 16.8,45.4 C15.-
N$17
  Top 0.406: R16.1 R14.2 16.8,43.18 C16.-
N$18
  Top 0.406: ADC.2 46.99,28.26 47.62,28.89 C19.2 47.59,30.45 C22.+
N$19
  Top 0.406: ADC.5 44.45,26.35 44.13,26.04 44.13,25.4 43.81,25.08 C21.2 | C21.2 | C21.2 38.77,25.08 C20.+ 38.39,24.77 37.47,24.77 37.15,24.45 R17.1
N$20
  Top 0.406: 50.8,28.89 ADC.16 52.07,28.89 52.7,29.53 C23.1 55.53,30.48 C24.+ 55.59,30.48 R18.1
N$25
  Top 0.406: ADC.9 51.75,24.45 52.07,24.13 C25.2 54.9,22.86 C26.+ 54.96,22.86 R19.2
RIGHT_DAC_OUT
  Top 0.406: C18.1 JACK_OUT.RING 6.71,43.18 R14.1
RIGHT_IN
  Top 0.406: JACK_IN.RING 5.08,13.97 6.35,15.24 10.16,15.24 12.7,12.7 C9.-
RIGHT_PREAMP_OUT  (via drill 0.6)
  Top 0.406: C7.- 31.75,20.95 32.38,21.59 JP2.2 | ADC.3 44.45,27.62 v43.18,26.35
  Bottom 0.406: JP2.2 38.42,21.59 v43.18,26.35
V+  (via drill 0.6)
  Top 0.406: U2.8 24.77,18.1 C2.1 25.09,16.19 | 25.09,16.19 25.09,14.96 C3.+ 24.77,14.57 24.77,13.02 24.45,12.7 R6.2 | R17.2 v41.27,22.54 | R2.2 v32.38,10.16 | v22.86,16.19 25.09,16.19 | R18.2 v58.42,34.29 | R10.2 v43.81,41.59 | JP4.1 C28.+
  Bottom 0.406: v41.27,22.54 41.27,20.64 39.37,18.73 | v32.38,10.16 32.38,15.24 | 32.38,15.24 31.43,16.19 v22.86,16.19 | 39.37,18.73 35.88,18.73 32.38,15.24 | v43.81,41.59 43.81,42.55 50.16,42.55 v58.42,34.29 60.64,34.29 61.59,33.34 61.59,14.29 56.83,9.53 47.94,9.53 45.72,11.75 | 39.37,18.73 39.37,13.65 41.91,11.11 45.09,11.11 45.72,11.75 | 45.72,11.75 JP4.1

### Text on the board
Top: ADAC v0.1
tNames: OUT | LM358 | GAIN | ADAC v0.1 | IN